# Altium project Led Strip 8mm.PrjPcb
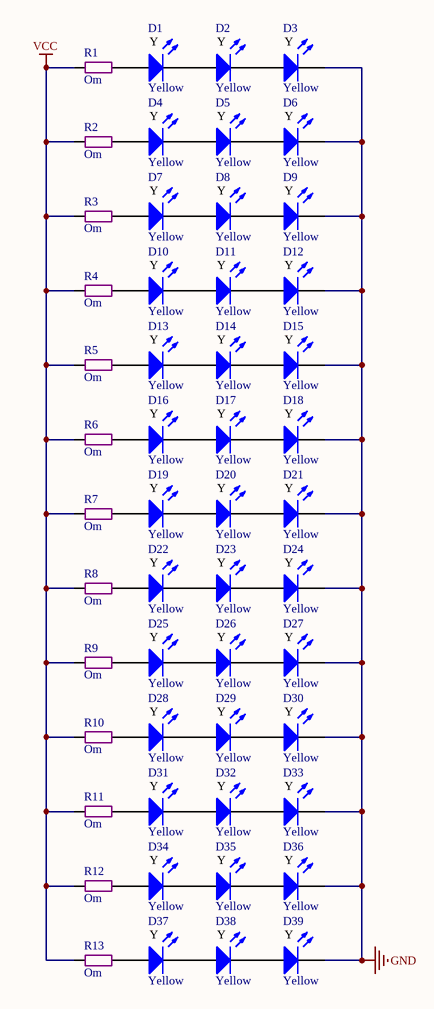
[diagram p0: Led Strip 8mm.SchDoc]
1 sheet, 52 parts. Net scope: global (net labels, ports and power ports of the same name join across sheets).
Board file: Led Strip 8mm.PcbDoc

## Sheet Led Strip 8mm.SchDoc
size A4

### Parts
D1  Yellow  [LED Round 8mm Yellow]
D2  Yellow  [LED Round 8mm Yellow]
D3  Yellow  [LED Round 8mm Yellow]
D4  Yellow  [LED Round 8mm Yellow]
D5  Yellow  [LED Round 8mm Yellow]
D6  Yellow  [LED Round 8mm Yellow]
D7  Yellow  [LED Round 8mm Yellow]
D8  Yellow  [LED Round 8mm Yellow]
D9  Yellow  [LED Round 8mm Yellow]
D10  Yellow  [LED Round 8mm Yellow]
D11  Yellow  [LED Round 8mm Yellow]
D12  Yellow  [LED Round 8mm Yellow]
D13  Yellow  [LED Round 8mm Yellow]
D14  Yellow  [LED Round 8mm Yellow]
D15  Yellow  [LED Round 8mm Yellow]
D16  Yellow  [LED Round 8mm Yellow]
D17  Yellow  [LED Round 8mm Yellow]
D18  Yellow  [LED Round 8mm Yellow]
D19  Yellow  [LED Round 8mm Yellow]
D20  Yellow  [LED Round 8mm Yellow]
D21  Yellow  [LED Round 8mm Yellow]
D22  Yellow  [LED Round 8mm Yellow]
D23  Yellow  [LED Round 8mm Yellow]
D24  Yellow  [LED Round 8mm Yellow]
D25  Yellow  [LED Round 8mm Yellow]
D26  Yellow  [LED Round 8mm Yellow]
D27  Yellow  [LED Round 8mm Yellow]
D28  Yellow  [LED Round 8mm Yellow]
D29  Yellow  [LED Round 8mm Yellow]
D30  Yellow  [LED Round 8mm Yellow]
D31  Yellow  [LED Round 8mm Yellow]
D32  Yellow  [LED Round 8mm Yellow]
D33  Yellow  [LED Round 8mm Yellow]
D34  Yellow  [LED Round 8mm Yellow]
D35  Yellow  [LED Round 8mm Yellow]
D36  Yellow  [LED Round 8mm Yellow]
D37  Yellow  [LED Round 8mm Yellow]
D38  Yellow  [LED Round 8mm Yellow]
D39  Yellow  [LED Round 8mm Yellow]
R1  Om  [Res p20.32 (9p) 2w]
R2  Om  [Res p20.32 (9p) 2w]
R3  Om  [Res p20.32 (9p) 2w]
R4  Om  [Res p20.32 (9p) 2w]
R5  Om  [Res p20.32 (9p) 2w]
R6  Om  [Res p20.32 (9p) 2w]
R7  Om  [Res p20.32 (9p) 2w]
R8  Om  [Res p20.32 (9p) 2w]
R9  Om  [Res p20.32 (9p) 2w]
R10  Om  [Res p20.32 (9p) 2w]
R11  Om  [Res p20.32 (9p) 2w]
R12  Om  [Res p20.32 (9p) 2w]
R13  Om  [Res p20.32 (9p) 2w]

### Nets
GND: D3.K D6.K D9.K D12.K D15.K D18.K D21.K D24.K D27.K D30.K D33.K D36.K D39.K
VCC: R1.1 R2.1 R3.1 R4.1 R5.1 R6.1 R7.1 R8.1 R9.1 R10.1 R11.1 R12.1 R13.1
NetD1_A: D1.A R1.2
NetD1_K: D1.K D2.A
NetD2_K: D2.K D3.A
NetD4_A: D4.A R2.2
NetD4_K: D4.K D5.A
NetD5_K: D5.K D6.A
NetD7_A: D7.A R3.2
NetD7_K: D7.K D8.A
NetD8_K: D8.K D9.A
NetD10_A: D10.A R4.2
NetD10_K: D10.K D11.A
NetD11_K: D11.K D12.A
NetD13_A: D13.A R5.2
NetD13_K: D13.K D14.A
NetD14_K: D14.K D15.A
NetD16_A: D16.A R6.2
NetD16_K: D16.K D17.A
NetD17_K: D17.K D18.A
NetD19_A: D19.A R7.2
NetD19_K: D19.K D20.A
NetD20_K: D20.K D21.A
NetD22_A: D22.A R8.2
NetD22_K: D22.K D23.A
NetD23_K: D23.K D24.A
NetD25_A: D25.A R9.2
NetD25_K: D25.K D26.A
NetD26_K: D26.K D27.A
NetD28_A: D28.A R10.2
NetD28_K: D28.K D29.A
NetD29_K: D29.K D30.A
NetD31_A: D31.A R11.2
NetD31_K: D31.K D32.A
NetD32_K: D32.K D33.A
NetD34_A: D34.A R12.2
NetD34_K: D34.K D35.A
NetD35_K: D35.K D36.A
NetD37_A: D37.A R13.2
NetD37_K: D37.K D38.A
NetD38_K: D38.K D39.A

### Notes on the sheet
- (in symbol Led Round 8mm Yellow 0.5W) Y

### Library data of the parts
D1-D39 = Led Round 8mm Yellow 0.5W: 2.8-3v 25mA, 4-5cd; Forward Voltage Min: 2.8; Forward Voltage TYP: 3; Wave len min/typ: 580/590; Liminous Min (mcd): 4000; Liminous Typ (mcd): 5000; Forward Amp (mA): 25; Color: Yellow
R1-R13 = Res 2W: 5W Cement